# EAGLE design eeZeeRGB (EAGLE 7.1.0)
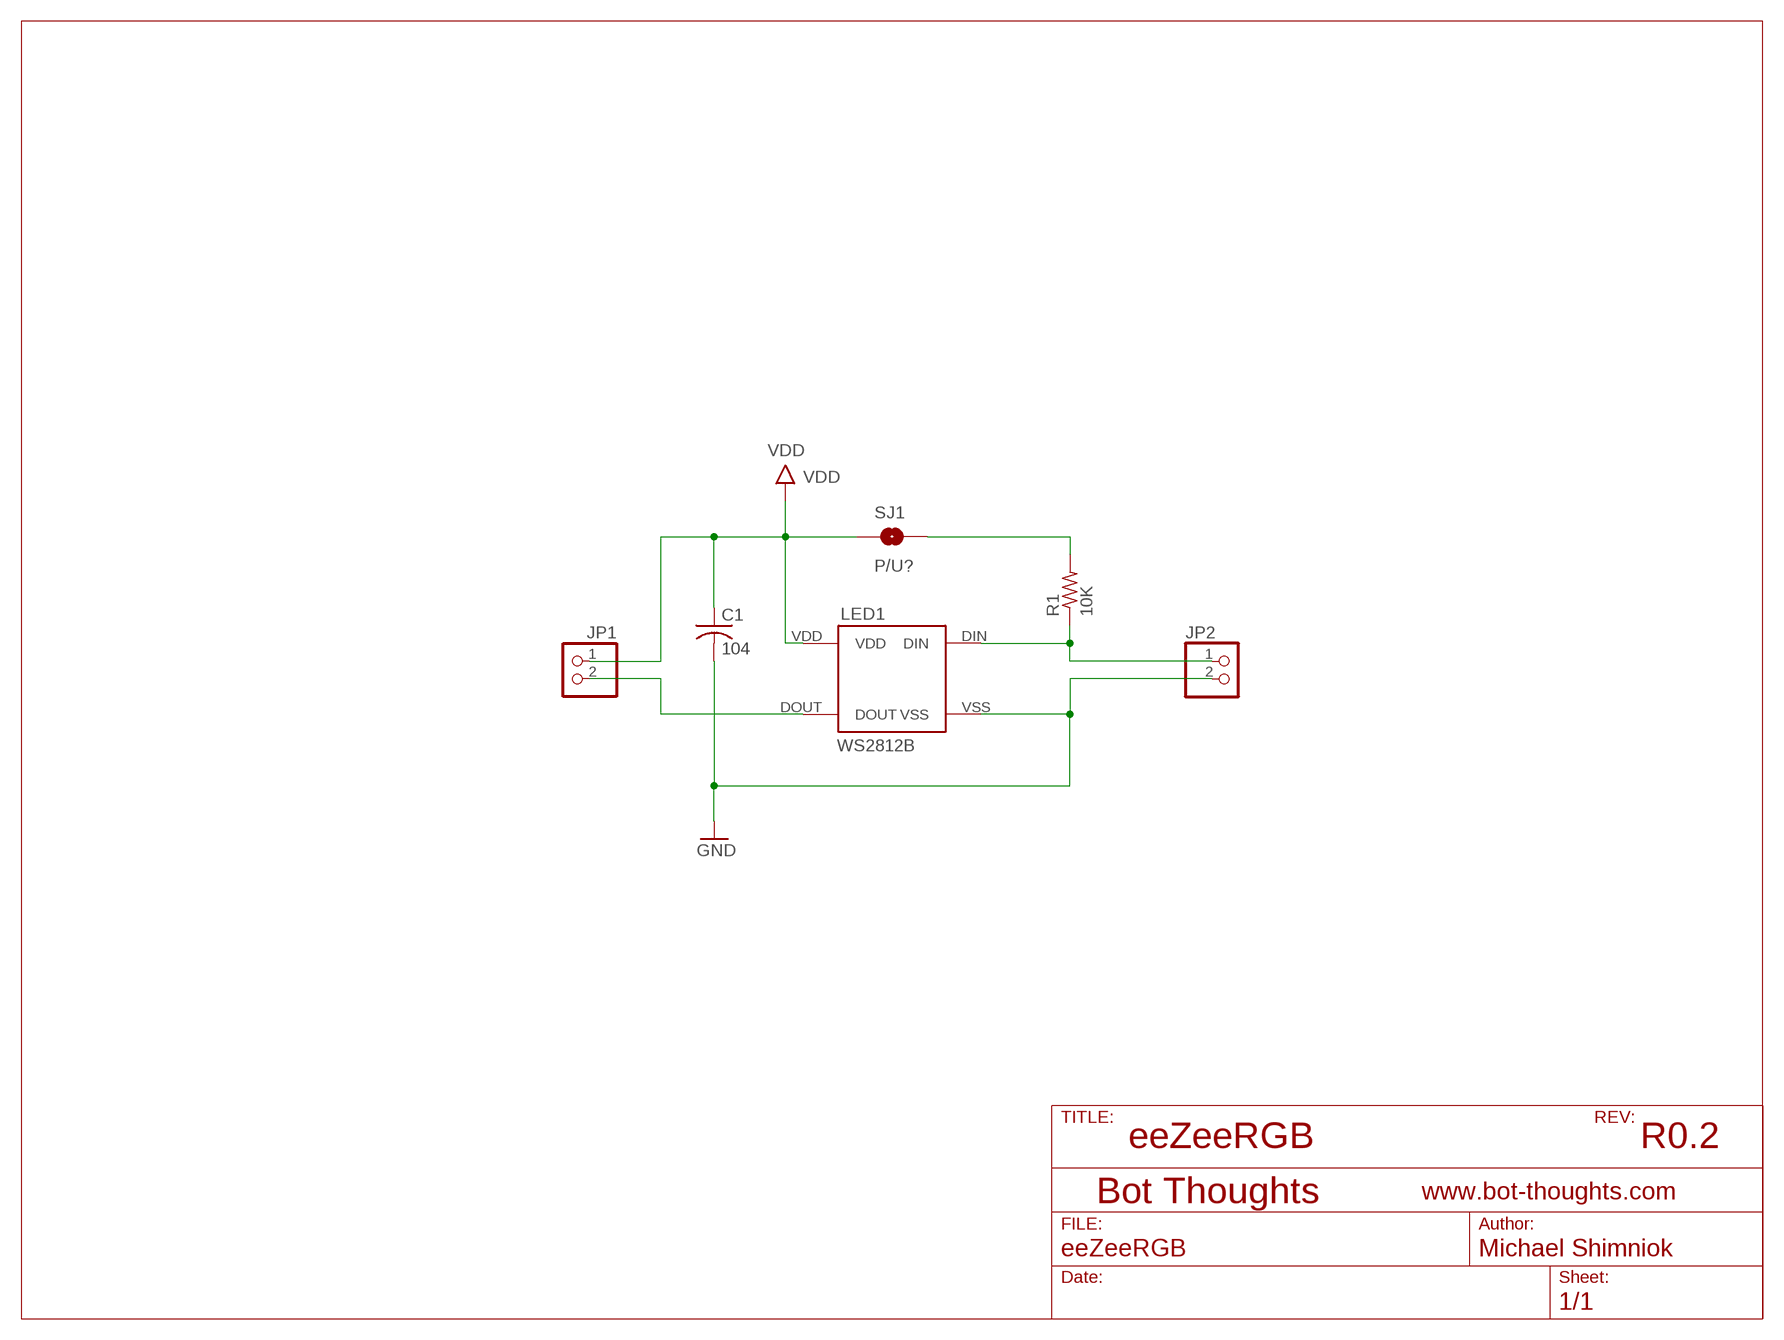
[diagram p0: schematic, sheet 1]

## Parts
C1  104  C-USC0603  [C0603]
JP1  PINHD-1X02_2.54-S  [1X02-S]
JP2  PINHD-1X02_2.54-S  [1X02-S]
LED1  WS2812B  [WS2812B]
R1  10K  R-US_R0603  [R0603]
SJ1  P/U?  SOLDERJUMPER-OLDNC  [SJ_2S]

## Nets
DIN: JP2.1 LED1.DIN R1.1
DOUT: JP1.2 LED1.DOUT
GND: C1.2 JP2.2 LED1.VSS
N$1: R1.2 SJ1.2
VDD: C1.1 JP1.1 LED1.VDD SJ1.1

## Notes on the sheet
- eeZeeRGB | R0.2

## Library data of the parts
C1 = rcl:C-US: CAPACITOR, American symbol
JP1 JP2 = pinhead-2:PINHD-1X02: PIN HEADER
LED1 = bt_opto:WS2812B: WS2812B Intelligent Control LED WS2812B is a intelligent control LED light source that the control circuit and RGB chip are integrated in a package of 5050 components. It internal include intelligent digital port data latch and signal reshaping amplification drive circuit. Also include a precision internal oscillator and a 12V voltage programmable constant current control part, effectively ensuring the pixel point light color height consistent. Datasheet.pdf <http://www.mikrocontroller.net/attachment/180459/WS2812B_preliminary.pdf>
R1 = rcl:R-US_: RESISTOR, American symbol
SJ1 = SparkFun-Retired:SOLDERJUMPER-OLD: Solder Jumper Standard SMD solder jumper. Used to automate production. Two varients : Normally Open and Normally Closed are the same, but have different paste layers. NC will have a large amount of paste and should jumper during reflow.

## Board
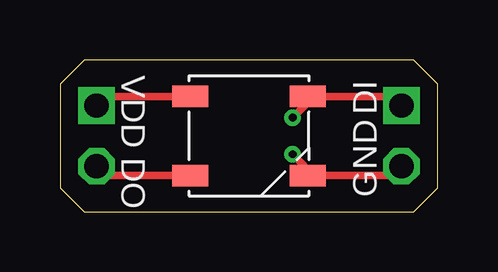
[diagram p1: board, top side]
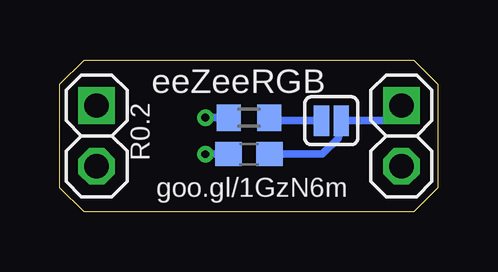
[diagram p2: board, bottom side, seen from below]

Size 15.75 x 6.35 mm. Coordinates in mm from the lower left corner, seen from the top.
Outline: 0,5.33 0,1.02 1.02,0 14.73,0 15.75,1.02 15.75,5.33 14.73,6.35 1.02,6.35 0,5.33
Copper layers (1*16): Top 0.0356mm / dielectric 1.5011mm / Bottom 0.0356mm
Design rules "LaenPCBOrder *": minimum track width 6mil, minimum drill 13mil, track to track 10mil, track to pad 10mil, pad to pad 10mil, via to via 10mil, smd to smd 8mil, copper to edge 10mil, drill to drill 10mil, minimum pad ring 7mil, minimum via ring 7mil, stop-mask expansion 3mil, vias tented up to drill 20mil, thermal gap 10mil

### Footprints (pad centres in the part's own frame; a part is rotated, then mirrored left to right if it is on the bottom)
C0603 = smd 1.1 x 1: 1 -0.85,0; 2 0.85,0
1X02-S = drill 1.016 square: 1 -1.27,0 | drill 1.016 octagon: 2 1.27,0
WS2812B = smd 1.5 x 0.9: DIN 2.45,1.65; DOUT -2.45,-1.65; VDD -2.45,1.65; VSS 2.45,-1.65
R0603 = smd 1 x 1.1: 1 -0.85,0; 2 0.85,0
SJ_2S = smd 0.635 x 1.27: 1 -0.412,0; 2 0.412,0

### Placement (x,y rotation side)
C1  7.87,2.41 180 bottom
JP1  1.52,3.17 270 bottom
JP2  14.22,3.17 270 bottom
LED1  7.87,3.17 0 top
R1  7.87,3.94 0 bottom
SJ1  4.45,3.81 180 bottom

### Tracks (layer width: path | path; a pad name or v marks a point on that pad's centre or on a via)
DIN  (via drill 0.33)
  Top 0.305: v9.69,3.94 10.32,4.57 LED1.DIN 13.84,4.83 JP2.1
  Bottom 0.305: R1.1 v9.69,3.94
DOUT
  Top 0.305: LED1.DOUT 1.9,1.52 JP1.2
GND  (via drill 0.33)
  Top 0.305: v9.69,2.41 10.16,1.94 10.16,1.91 10.32,1.74 LED1.VSS 13.84,1.52 JP2.2
  Bottom 0.305: C1.2 v9.69,2.41
N$1
  Bottom 0.305: SJ1.2 6.86,3.81 R1.2
VDD
  Top 0.305: LED1.VDD 1.9,4.83 JP1.1
  Bottom 0.305: C1.1 4.83,2.41 4.16,3.08 SJ1.1 2.16,3.81 JP1.1

### Text on the board
tPlace: VDD | DI | DO | GND
bNames: eeZeeRGB | R0.2 | goo.gl/1GzN6m
tsilk: VDD | DI | DO | VSS
bsilk: 104 | eeZeeRGB | 10K | ow.ly/qL2Hf